# EAGLE design LongTermTempMon (EAGLE 6.5.0)
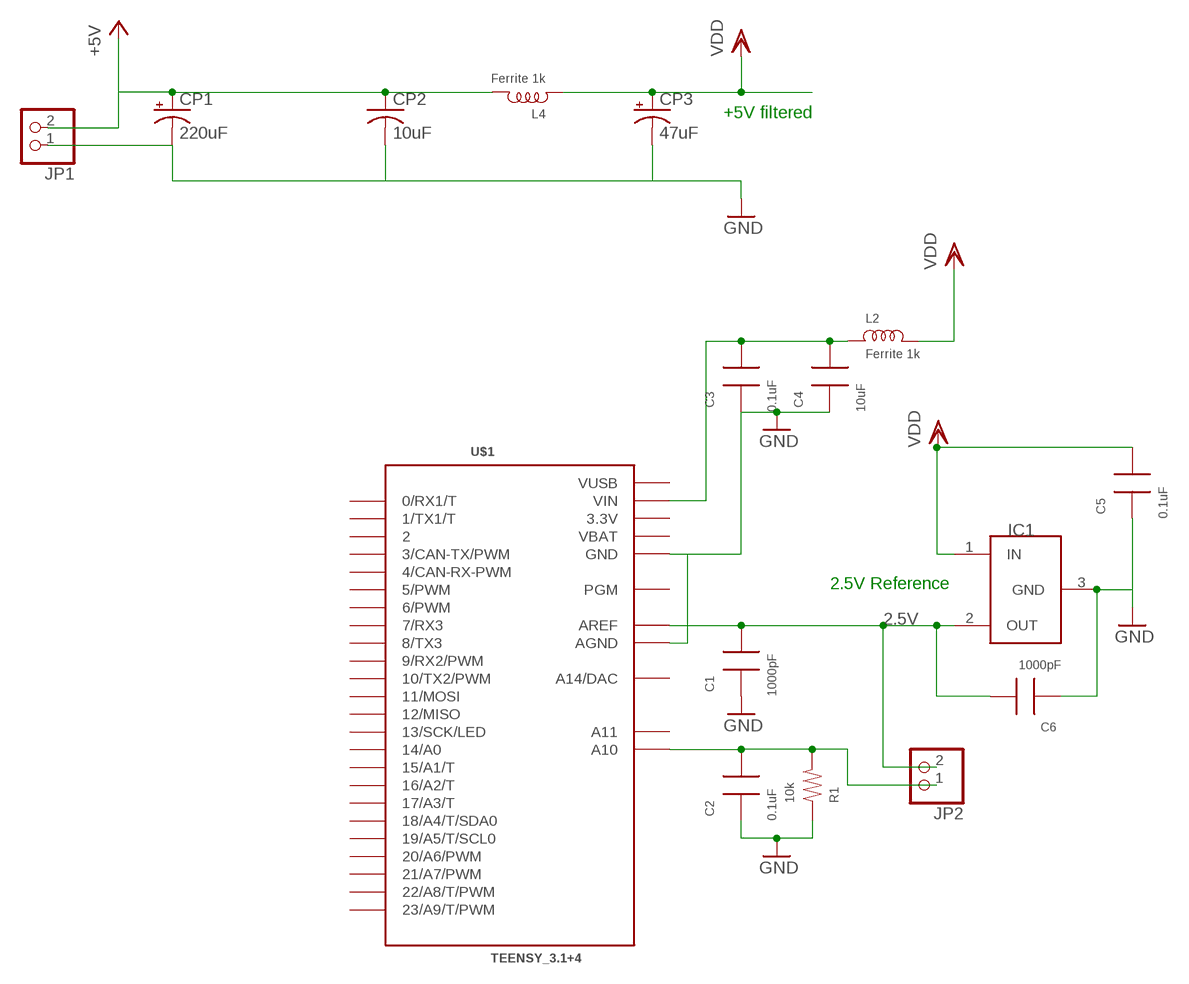
[diagram p0: schematic, sheet 1]

## Parts
C1  1000pF  CAP0603  [0603]
C2  0.1uF  CAP0603  [0603]
C3  0.1uF  CAP0603  [0603]
C4  10uF  CAP0805  [0805]
C5  0.1uF  CAP0603  [0603]
C6  1000pF  CAP0603  [0603]
CP1  220uF  CPOL-USF  [PANASONIC_F]
CP2  10uF  C-USC0805K  [C0805K]
CP3  47uF  CPOL-USCT7343  [CT7343]
IC1  TS6001  [SOT-23]
JP1  SCRWTRM-1X2  [1X02_SCRWTRM]
JP2  SCRWTRM-1X2  [1X02_SCRWTRM]
L2  Ferrite 1k  INDUCTOR-0805  [0805]
L4  Ferrite 1k  INDUCTOR-0805  [0805]
R1  10k  RES1206  [1206]
U$1  TEENSY_3.1+4  [TEENSY_3.1+4]

## Nets
2.5V: C1.2 C6.2 IC1.2(OUT) JP2.2 U$1.AREF
+5V: CP1.+ CP2.1 JP1.2 L4.2
GND: C1.1 C2.1 C3.1 C4.1 C5.1 C6.1 CP1.- CP2.2 CP3.- IC1.3(GND) JP1.1 R1.1 U$1.AGND U$1.GND U$1.GND1(GND)
N$1: C2.2 JP2.1 R1.2 U$1.A10
N$25: C3.2 C4.2 L2.1 U$1.VIN
VDD: C5.2 CP3.+ IC1.1(IN) L2.2 L4.1
Unconnected: U$1.0(0/RX1/T) U$1.1(1/TX1/T) U$1.2 U$1.3(3/CAN-TX/PWM) U$1.4(4/CAN-RX-PWM) U$1.5(5/PWM) U$1.6(6/PWM) U$1.7(7/RX3) U$1.8(8/TX3) U$1.9(9/RX2/PWM) U$1.10(10/TX2/PWM) U$1.11(11/MOSI) U$1.12(12/MISO) U$1.13(13/SCK/LED) U$1.14/A0 U$1.15/A1(15/A1/T) U$1.16/A2(16/A2/T) U$1.17/A3(17/A3/T) U$1.18/A4(18/A4/T/SDA0) U$1.19/A5(19/A5/T/SCL0) U$1.20/A6(20/A6/PWM) U$1.21/A7(21/A7/PWM) U$1.22/A8(22/A8/T/PWM) U$1.23/A9(23/A9/T/PWM) U$1.A11 U$1.A14(A14/DAC) U$1.PGM

## Notes on the sheet
- +5V filtered
- 2.5V Reference

## Power pins joined to a net without a drawn wire
3.3V: U$1.3.3V U$1.3.3V1(3.3V)
VBAT: U$1.VBAT
VUSB: U$1.VUSB

## Library data of the parts
C1-C6 = rlc-jqi:CAP: SMT Capacitor
CP1 CP3 = rcl:CPOL-US: POLARIZED CAPACITOR, American symbol
CP2 = rcl:C-US: CAPACITOR, American symbol
IC1 = Lin-Temp-Controller:TS6001: 2.5V Reference IC; DIGIKEY: TS6001BIG325TCT-ND
JP1 JP2 = Lin-Temp-Controller:SCRWTRM-1X2: Screw Terminal; DIGIKEY: ED2635-ND; MFR_PN: OSTTE020161
L2 L4 = rlc-jqi:INDUCTOR: SMT Inductor.
R1 = rlc-jqi:RES: SMT Resistor
U$1 = mcu-accessories:TEENSY_3.1+4: Footprint for Teensy 3.1 board using all through-holes, i.e. the entire perimeter plus the 4 through-holes inboard (A10,A11,AREF, VUSB)

## Board
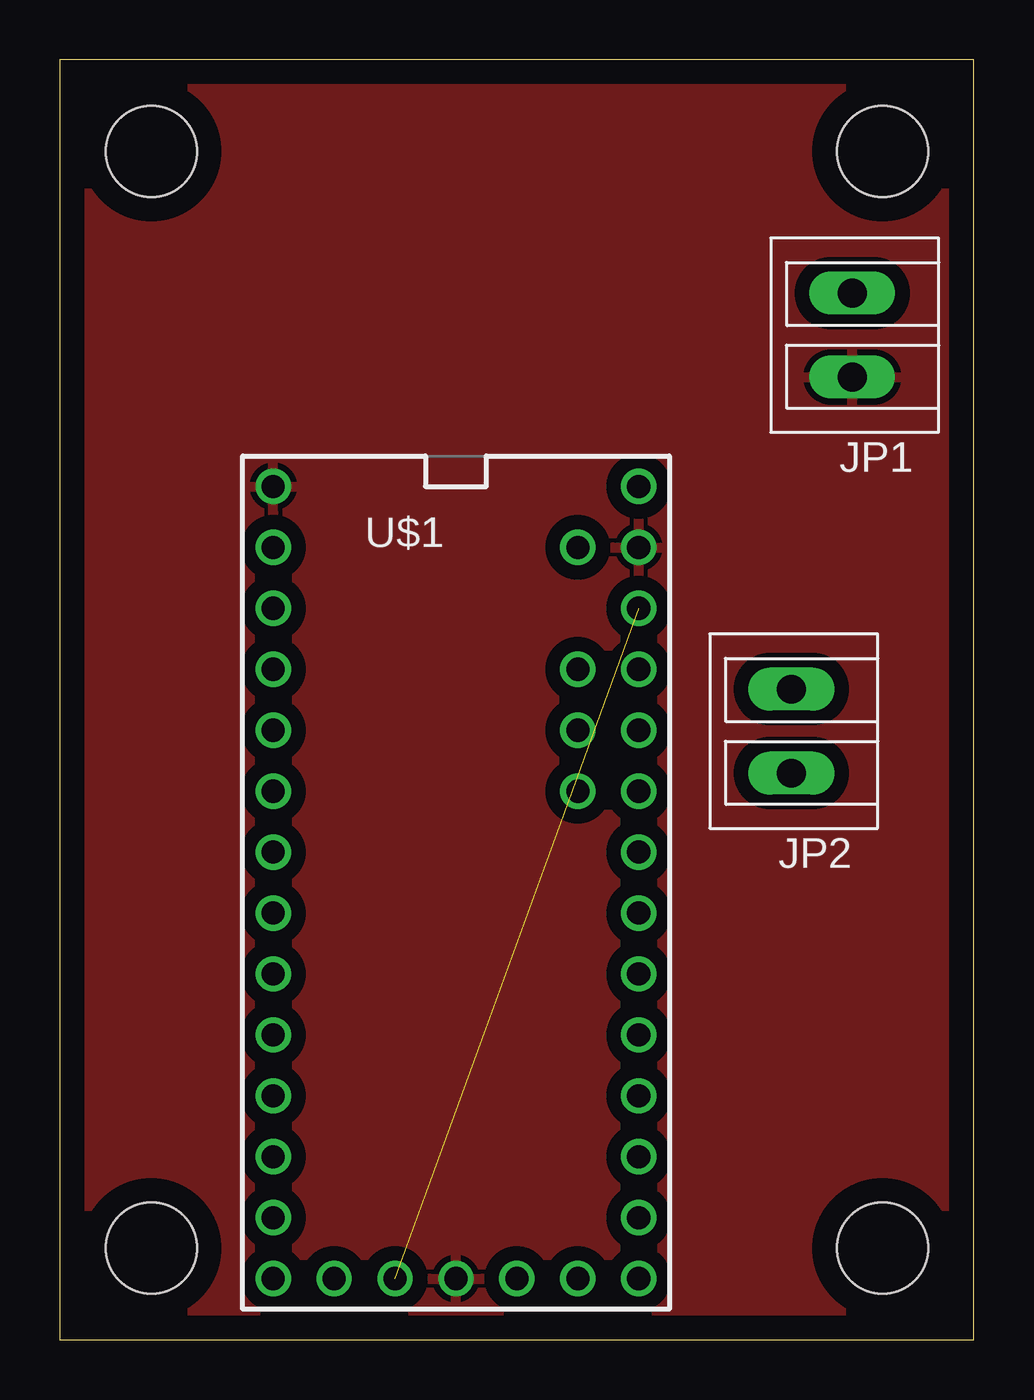
[diagram p1: board, top side]
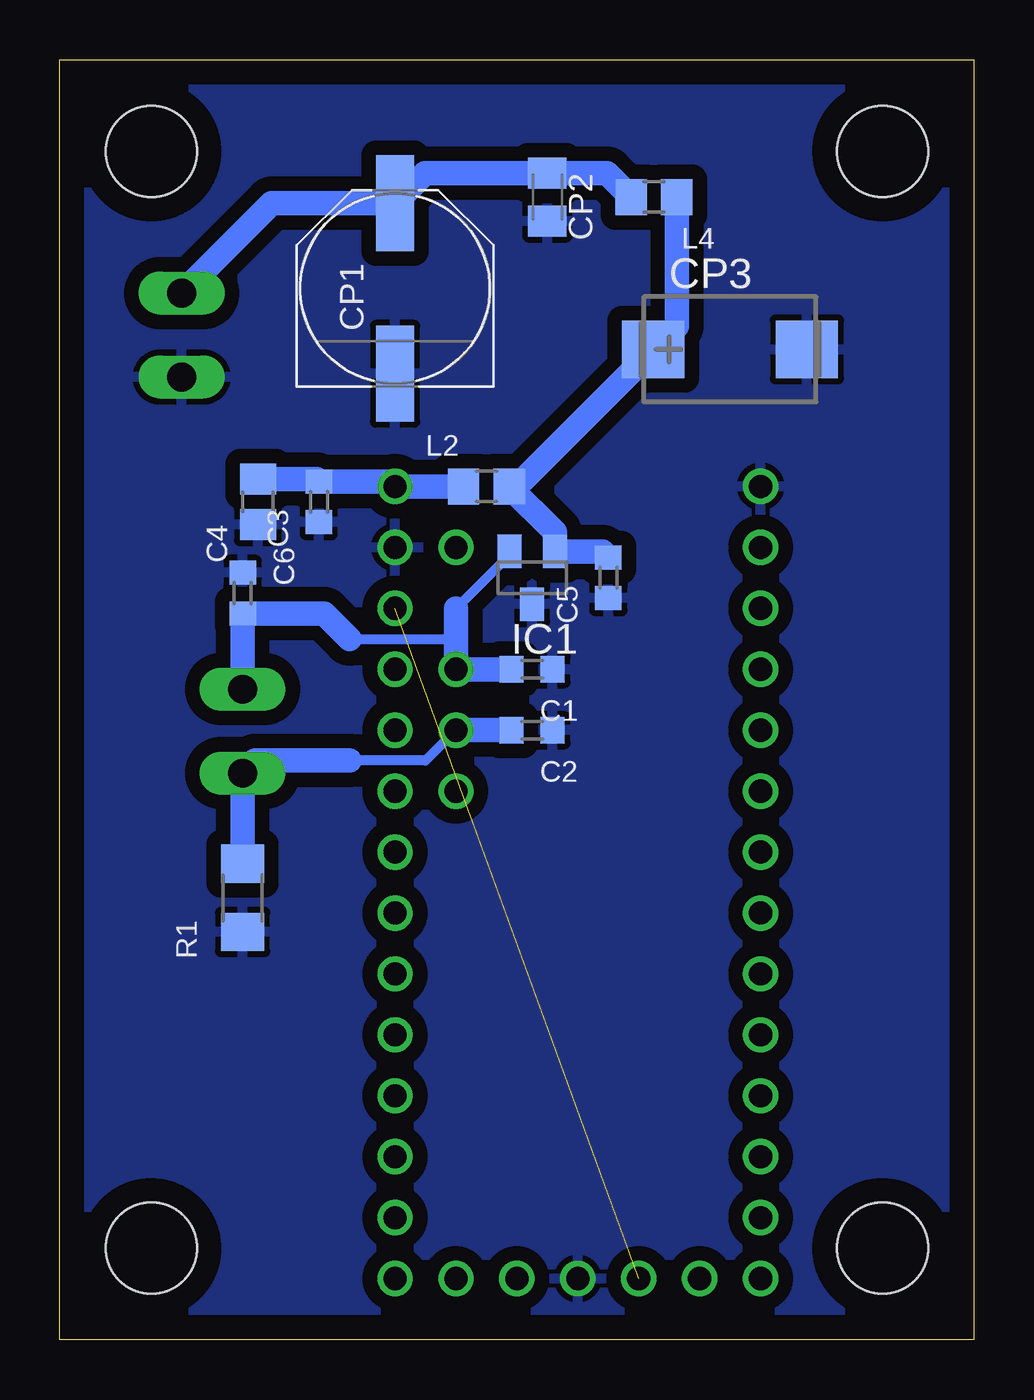
[diagram p2: board, bottom side, seen from below]

Size 38.1 x 53.34 mm. Coordinates in mm from the lower left corner, seen from the top.
Outline: 0,0 38.1,0 38.1,53.34 0,53.34 0,0
Copper layers (1*16): Top 0.035mm / dielectric 1.5mm / Bottom 0.035mm
Design rules "default": minimum track width 10mil, minimum drill 24mil, track to track 8mil, track to pad 8mil, pad to pad 8mil, via to via 8mil, smd to smd 8mil, copper to edge 40mil, drill to drill 8mil, minimum pad ring 10mil, minimum via ring 8mil, stop-mask expansion 4mil, vias tented up to drill 0mil, thermal gap 10mil
Holes 3.8 mm at 3.81,3.81 3.81,49.53 34.29,49.53 34.29,3.81

### Footprints (pad centres in the part's own frame; a part is rotated, then mirrored left to right if it is on the bottom)
0603 = smd 1 x 1.1: 1 -0.85,0; 2 0.85,0
0805 = smd 1.3 x 1.5: 1 -0.95,0; 2 0.95,0
PANASONIC_F = smd 4 x 1.6: + 3.55,0; - -3.55,0
C0805K = smd 1.3 x 1.6: 1 -1,0; 2 1,0
CT7343 = smd 2.6 x 2.4: + -3.2,0; - 3.2,0
SOT-23 = smd 1 x 1.4: 1 -0.95,-1.1; 2 0.95,-1.1; 3 0,1.1
1X02_SCRWTRM = drill 1.2 long: 1 -1.79,-0.01; 2 1.71,-0.01
1206 = smd 1.6 x 1.803: 1 -1.422,0; 2 1.422,0
TEENSY_3.1+4 = drill 0.965: 0 -7.62,15.24; 1 -7.62,12.7; 2 -7.62,10.16; 3 -7.62,7.62; 3.3V 7.62,12.7; 3.3V1 -2.54,-15.24; 4 -7.62,5.08; 5 -7.62,2.54; 6 -7.62,0; 7 -7.62,-2.54; 8 -7.62,-5.08; 9 -7.62,-7.62; 10 -7.62,-10.16; 11 -7.62,-12.7; 12 -7.62,-15.24; 13 7.62,-15.24; 14/A0 7.62,-12.7; 15/A1 7.62,-10.16; 16/A2 7.62,-7.62; 17/A3 7.62,-5.08; 18/A4 7.62,-2.54; 19/A5 7.62,0; 20/A6 7.62,2.54; 21/A7 7.62,5.08; 22/A8 7.62,7.62; 23/A9 7.62,10.16; A10 5.08,7.62; A11 5.08,5.08; A14 5.08,-15.24; AGND 7.62,15.24; AREF 5.08,10.16; GND -7.62,17.78; GND1 0,-15.24; PGM 2.54,-15.24; VBAT -5.08,-15.24; VIN 7.62,17.78; VUSB 5.08,15.24

### Placement (x,y rotation side)
C1  18.41,27.94 180 bottom
C2  18.41,25.4 180 bottom
C3  27.3,34.92 90 bottom
C4  29.84,34.92 90 bottom
C5  15.24,31.75 90 bottom
C6  30.48,31.11 270 bottom
CP1  24.13,43.81 90 bottom
CP2  17.78,47.62 270 bottom
CP3  10.16,41.27 0 bottom
IC1  18.41,31.75 180 bottom
JP1  33.02,41.91 90 top
JP2  30.48,25.4 90 top
L2  20.32,35.56 0 bottom
L4  13.34,47.62 180 bottom
R1  30.48,18.41 90 bottom
U$1  16.51,17.78 0 top

### Tracks (layer width: path | path; a pad name or v marks a point on that pad's centre or on a via)
2.5V
  Bottom 0.406: IC1.2 19.36,32.7 21.59,30.48 | 26.04,29.21 21.59,29.21
  Bottom 1.016: C1.2 U$1.AREF 21.59,29.21 21.59,30.48 | JP2.2 30.49,29.62 C6.2 27.09,30.27 26.04,29.21
3.3V  (1 unrouted)
+5V
  Bottom 1.016: L4.2 15.29,48.62 CP2.1 22.87,48.62 CP1.+ 29.29,47.37 JP1.2
GND
  pour Bottom (isolate 0.61): -2.54,54.61 -2.54,-2.54 40.64,-2.54 40.64,54.61
  pour Top (isolate 0.61): -1.27,54.61 -1.27,-2.54 40.64,-2.54 40.64,54.61
N$1
  Bottom 0.406: U$1.A10 22.86,24.13 26.04,24.13
  Bottom 1.016: U$1.A10 C2.2 | R1.2 JP2.1 29.97,24.13 26.04,24.13
N$25
  Bottom 1.016: C4.2 27.41,35.88 C3.2 24.34,35.77 U$1.VIN L2.1
VDD
  Bottom 1.016: L4.1 12.38,42.25 CP3.+ 19.07,35.56 L2.2 17.46,33.66 IC1.1 15.49,32.85 C5.2